# EAGLE design big7segment (EAGLE 6.5.0)
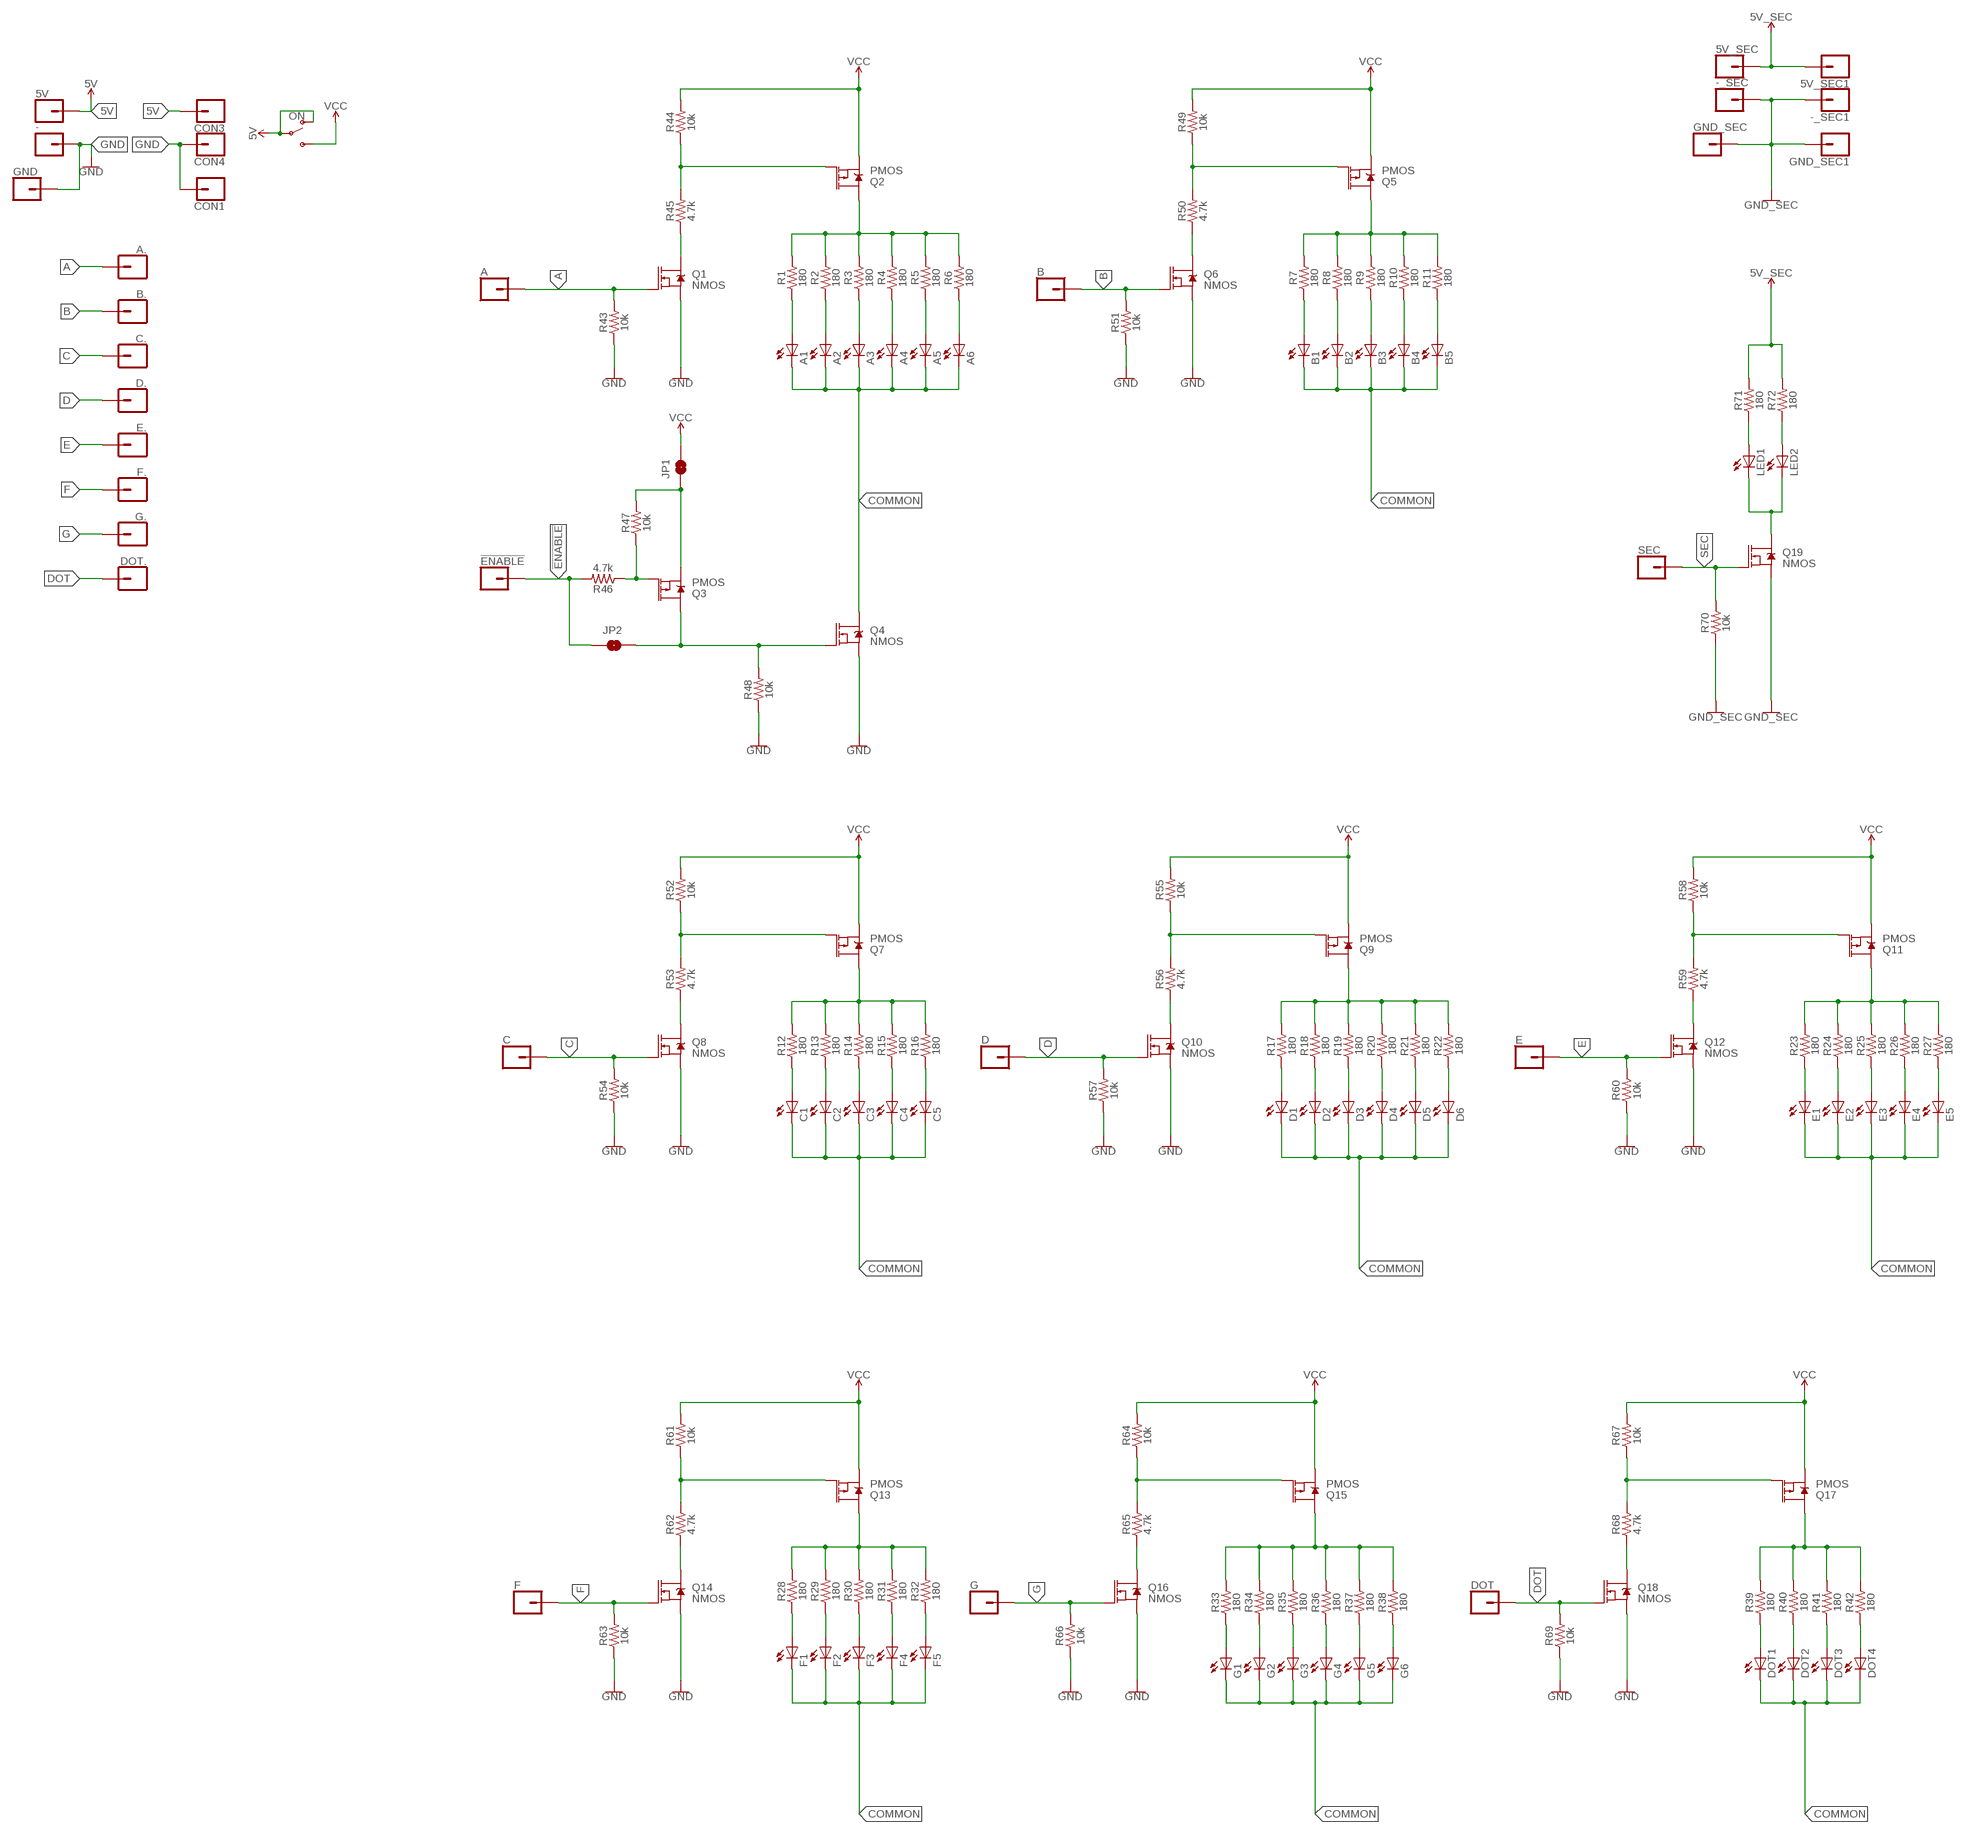
[diagram p0: schematic, sheet 1]

## Parts
5V  CONN_01OFFSET  [1X01_OFFSET]
5V_SEC  CONN_01OFFSET  [1X01_OFFSET]
5V_SEC1  CONN_01OFFSET  [1X01_OFFSET]
!ENABLE!  CONN_01OFFSET  [1X01_OFFSET]
-  CONN_01OFFSET  [1X01_OFFSET]
-_SEC  CONN_01OFFSET  [1X01_OFFSET]
-_SEC1  CONN_01OFFSET  [1X01_OFFSET]
A  CONN_01OFFSET  [1X01_OFFSET]
A1  LEDSML0805  [SML0805]
A2  LEDSML0805  [SML0805]
A3  LEDSML0805  [SML0805]
A4  LEDSML0805  [SML0805]
A5  LEDSML0805  [SML0805]
A6  LEDSML0805  [SML0805]
A.  CONN_01OFFSET  [1X01_OFFSET]
B  CONN_01OFFSET  [1X01_OFFSET]
B1  LEDSML0805  [SML0805]
B2  LEDSML0805  [SML0805]
B3  LEDSML0805  [SML0805]
B4  LEDSML0805  [SML0805]
B5  LEDSML0805  [SML0805]
B.  CONN_01OFFSET  [1X01_OFFSET]
C  CONN_01OFFSET  [1X01_OFFSET]
C1  LEDSML0805  [SML0805]
C2  LEDSML0805  [SML0805]
C3  LEDSML0805  [SML0805]
C4  LEDSML0805  [SML0805]
C5  LEDSML0805  [SML0805]
C.  CONN_01OFFSET  [1X01_OFFSET]
CON1  CONN_01OFFSET  [1X01_OFFSET]
CON3  CONN_01OFFSET  [1X01_OFFSET]
CON4  CONN_01OFFSET  [1X01_OFFSET]
D  CONN_01OFFSET  [1X01_OFFSET]
D1  LEDSML0805  [SML0805]
D2  LEDSML0805  [SML0805]
D3  LEDSML0805  [SML0805]
D4  LEDSML0805  [SML0805]
D5  LEDSML0805  [SML0805]
D6  LEDSML0805  [SML0805]
D.  CONN_01OFFSET  [1X01_OFFSET]
DOT  CONN_01OFFSET  [1X01_OFFSET]
DOT1  LEDSML0805  [SML0805]
DOT2  LEDSML0805  [SML0805]
DOT3  LEDSML0805  [SML0805]
DOT4  LEDSML0805  [SML0805]
DOT.  CONN_01OFFSET  [1X01_OFFSET]
E  CONN_01OFFSET  [1X01_OFFSET]
E1  LEDSML0805  [SML0805]
E2  LEDSML0805  [SML0805]
E3  LEDSML0805  [SML0805]
E4  LEDSML0805  [SML0805]
E5  LEDSML0805  [SML0805]
E.  CONN_01OFFSET  [1X01_OFFSET]
F  CONN_01OFFSET  [1X01_OFFSET]
F1  LEDSML0805  [SML0805]
F2  LEDSML0805  [SML0805]
F3  LEDSML0805  [SML0805]
F4  LEDSML0805  [SML0805]
F5  LEDSML0805  [SML0805]
F.  CONN_01OFFSET  [1X01_OFFSET]
G  CONN_01OFFSET  [1X01_OFFSET]
G1  LEDSML0805  [SML0805]
G2  LEDSML0805  [SML0805]
G3  LEDSML0805  [SML0805]
G4  LEDSML0805  [SML0805]
G5  LEDSML0805  [SML0805]
G6  LEDSML0805  [SML0805]
G.  CONN_01OFFSET  [1X01_OFFSET]
GND  CONN_01OFFSET  [1X01_OFFSET]
GND_SEC  CONN_01OFFSET  [1X01_OFFSET]
GND_SEC1  CONN_01OFFSET  [1X01_OFFSET]
JP1  JUMPER-SMT_2_NC_TRACE_NO-SILK  [SMT-JUMPER_2_NC_TRACE_NO-SILK]
JP2  JUMPER-SMT_2_NO_NO-SILK  [SMT-JUMPER_2_NO_NO-SILK]
LED1  LED5MM  [LED5MM]
LED2  LED5MM  [LED5MM]
ON  SWITCH-SPDT-PTH-11.6X4.0MM  [SWITCH_SPDT_PTH_11.6X4.0MM]
Q1  NMOS  MOSFET-NCH-AO3404A  [SOT23-3]
Q2  PMOS  MOSFET_PCH-DMG2307L  [SOT23-3]
Q3  PMOS  MOSFET_PCH-DMG2307L  [SOT23-3]
Q4  NMOS  MOSFET-NCH-AO3404A  [SOT23-3]
Q5  PMOS  MOSFET_PCH-DMG2307L  [SOT23-3]
Q6  NMOS  MOSFET-NCH-AO3404A  [SOT23-3]
Q7  PMOS  MOSFET_PCH-DMG2307L  [SOT23-3]
Q8  NMOS  MOSFET-NCH-AO3404A  [SOT23-3]
Q9  PMOS  MOSFET_PCH-DMG2307L  [SOT23-3]
Q10  NMOS  MOSFET-NCH-AO3404A  [SOT23-3]
Q11  PMOS  MOSFET_PCH-DMG2307L  [SOT23-3]
Q12  NMOS  MOSFET-NCH-AO3404A  [SOT23-3]
Q13  PMOS  MOSFET_PCH-DMG2307L  [SOT23-3]
Q14  NMOS  MOSFET-NCH-AO3404A  [SOT23-3]
Q15  PMOS  MOSFET_PCH-DMG2307L  [SOT23-3]
Q16  NMOS  MOSFET-NCH-AO3404A  [SOT23-3]
Q17  PMOS  MOSFET_PCH-DMG2307L  [SOT23-3]
Q18  NMOS  MOSFET-NCH-AO3404A  [SOT23-3]
Q19  NMOS  MOSFET-NCH-AO3404A  [SOT23-3]
R1  180  0.3OHM-0805-1/8W-1%  [0805]
R2  180  0.3OHM-0805-1/8W-1%  [0805]
R3  180  0.3OHM-0805-1/8W-1%  [0805]
R4  180  0.3OHM-0805-1/8W-1%  [0805]
R5  180  0.3OHM-0805-1/8W-1%  [0805]
R6  180  0.3OHM-0805-1/8W-1%  [0805]
R7  180  0.3OHM-0805-1/8W-1%  [0805]
R8  180  0.3OHM-0805-1/8W-1%  [0805]
R9  180  0.3OHM-0805-1/8W-1%  [0805]
R10  180  0.3OHM-0805-1/8W-1%  [0805]
R11  180  0.3OHM-0805-1/8W-1%  [0805]
R12  180  0.3OHM-0805-1/8W-1%  [0805]
R13  180  0.3OHM-0805-1/8W-1%  [0805]
R14  180  0.3OHM-0805-1/8W-1%  [0805]
R15  180  0.3OHM-0805-1/8W-1%  [0805]
R16  180  0.3OHM-0805-1/8W-1%  [0805]
R17  180  0.3OHM-0805-1/8W-1%  [0805]
R18  180  0.3OHM-0805-1/8W-1%  [0805]
R19  180  0.3OHM-0805-1/8W-1%  [0805]
R20  180  0.3OHM-0805-1/8W-1%  [0805]
R21  180  0.3OHM-0805-1/8W-1%  [0805]
R22  180  0.3OHM-0805-1/8W-1%  [0805]
R23  180  0.3OHM-0805-1/8W-1%  [0805]
R24  180  0.3OHM-0805-1/8W-1%  [0805]
R25  180  0.3OHM-0805-1/8W-1%  [0805]
R26  180  0.3OHM-0805-1/8W-1%  [0805]
R27  180  0.3OHM-0805-1/8W-1%  [0805]
R28  180  0.3OHM-0805-1/8W-1%  [0805]
R29  180  0.3OHM-0805-1/8W-1%  [0805]
R30  180  0.3OHM-0805-1/8W-1%  [0805]
R31  180  0.3OHM-0805-1/8W-1%  [0805]
R32  180  0.3OHM-0805-1/8W-1%  [0805]
R33  180  0.3OHM-0805-1/8W-1%  [0805]
R34  180  0.3OHM-0805-1/8W-1%  [0805]
R35  180  0.3OHM-0805-1/8W-1%  [0805]
R36  180  0.3OHM-0805-1/8W-1%  [0805]
R37  180  0.3OHM-0805-1/8W-1%  [0805]
R38  180  0.3OHM-0805-1/8W-1%  [0805]
R39  180  0.3OHM-0805-1/8W-1%  [0805]
R40  180  0.3OHM-0805-1/8W-1%  [0805]
R41  180  0.3OHM-0805-1/8W-1%  [0805]
R42  180  0.3OHM-0805-1/8W-1%  [0805]
R43  10k  0.3OHM-0805-1/8W-1%  [0805]
R44  10k  0.3OHM-0805-1/8W-1%  [0805]
R45  4.7k  0.3OHM-0805-1/8W-1%  [0805]
R46  4.7k  0.3OHM-0805-1/8W-1%  [0805]
R47  10k  0.3OHM-0805-1/8W-1%  [0805]
R48  10k  0.3OHM-0805-1/8W-1%  [0805]
R49  10k  0.3OHM-0805-1/8W-1%  [0805]
R50  4.7k  0.3OHM-0805-1/8W-1%  [0805]
R51  10k  0.3OHM-0805-1/8W-1%  [0805]
R52  10k  0.3OHM-0805-1/8W-1%  [0805]
R53  4.7k  0.3OHM-0805-1/8W-1%  [0805]
R54  10k  0.3OHM-0805-1/8W-1%  [0805]
R55  10k  0.3OHM-0805-1/8W-1%  [0805]
R56  4.7k  0.3OHM-0805-1/8W-1%  [0805]
R57  10k  0.3OHM-0805-1/8W-1%  [0805]
R58  10k  0.3OHM-0805-1/8W-1%  [0805]
R59  4.7k  0.3OHM-0805-1/8W-1%  [0805]
R60  10k  0.3OHM-0805-1/8W-1%  [0805]
R61  10k  0.3OHM-0805-1/8W-1%  [0805]
R62  4.7k  0.3OHM-0805-1/8W-1%  [0805]
R63  10k  0.3OHM-0805-1/8W-1%  [0805]
R64  10k  0.3OHM-0805-1/8W-1%  [0805]
R65  4.7k  0.3OHM-0805-1/8W-1%  [0805]
R66  10k  0.3OHM-0805-1/8W-1%  [0805]
R67  10k  0.3OHM-0805-1/8W-1%  [0805]
R68  4.7k  0.3OHM-0805-1/8W-1%  [0805]
R69  10k  0.3OHM-0805-1/8W-1%  [0805]
R70  10k  0.3OHM-0805-1/8W-1%  [0805]
R71  180  0.3OHM-0805-1/8W-1%  [0805]
R72  180  0.3OHM-0805-1/8W-1%  [0805]
SEC  CONN_01OFFSET  [1X01_OFFSET]

## Nets
5V: 5V.1 CON3.1 ON.1(O) ON.2(P)
!ENABLE!: !ENABLE!.1 JP2.1 R46.2
A: A.1 A..1 Q1.1(G) R43.2
B: B.1 B..1 Q6.1(G) R51.2
C: C.1 C..1 Q8.1(G) R54.2
COMMON: A1.C A2.C A3.C A4.C A5.C A6.C B1.C B2.C B3.C B4.C B5.C C1.C C2.C C3.C C4.C C5.C D1.C D2.C D3.C D4.C D5.C D6.C DOT1.C DOT2.C DOT3.C DOT4.C E1.C E2.C E3.C E4.C E5.C F1.C F2.C F3.C F4.C F5.C G1.C G2.C G3.C G4.C G5.C G6.C Q4.3(D)
D: D.1 D..1 Q10.1(G) R57.2
DOT: DOT.1 DOT..1 Q18.1(G) R69.2
E: E.1 E..1 Q12.1(G) R60.2
F: F.1 F..1 Q14.1(G) R63.2
G: G.1 G..1 Q16.1(G) R66.2
GND: -.1 CON1.1 CON4.1 GND.1 Q1.2(S) Q4.2(S) Q6.2(S) Q8.2(S) Q10.2(S) Q12.2(S) Q14.2(S) Q16.2(S) Q18.2(S) R43.1 R48.1 R51.1 R54.1 R57.1 R60.1 R63.1 R66.1 R69.1
GND_SEC: -_SEC1.1 -_SEC.1 GND_SEC1.1 GND_SEC.1 Q19.2(S) R70.1
N$1: A1.A R1.1
N$2: A3.A R3.1
N$3: A4.A R4.1
N$4: A5.A R5.1
N$5: A6.A R6.1
N$6: A2.A R2.1
N$7: B1.A R7.1
N$8: B2.A R8.1
N$9: B3.A R9.1
N$10: B4.A R10.1
N$11: B5.A R11.1
N$12: C1.A R12.1
N$13: C2.A R13.1
N$14: C3.A R14.1
N$15: C4.A R15.1
N$16: C5.A R16.1
N$17: D1.A R17.1
N$18: D2.A R18.1
N$19: D3.A R19.1
N$20: D4.A R20.1
N$21: D5.A R21.1
N$22: D6.A R22.1
N$23: E1.A R23.1
N$24: E2.A R24.1
N$25: E3.A R25.1
N$26: E4.A R26.1
N$27: E5.A R27.1
N$28: F1.A R28.1
N$29: F2.A R29.1
N$30: F3.A R30.1
N$31: F4.A R31.1
N$32: F5.A R32.1
N$33: G1.A R33.1
N$34: G2.A R34.1
N$35: G3.A R35.1
N$36: G4.A R36.1
N$37: G5.A R37.1
N$38: G6.A R38.1
N$39: DOT1.A R39.1
N$40: DOT2.A R40.1
N$41: DOT3.A R41.1
N$42: DOT4.A R42.1
N$43: Q2.1(G) R44.1 R45.2
N$44: Q1.3(D) R45.1
N$45: Q5.1(G) R49.1 R50.2
N$46: Q2.3(D) R1.2 R2.2 R3.2 R4.2 R5.2 R6.2
N$47: Q3.1(G) R46.1 R47.1
N$48: JP2.2 Q3.3(D) Q4.1(G) R48.2
N$49: Q5.3(D) R7.2 R8.2 R9.2 R10.2 R11.2
N$50: Q11.1(G) R58.1 R59.2
N$51: Q12.3(D) R59.1
N$52: Q6.3(D) R50.1
N$53: Q7.1(G) R52.1 R53.2
N$54: Q8.3(D) R53.1
N$55: Q7.3(D) R12.2 R13.2 R14.2 R15.2 R16.2
N$56: Q9.1(G) R55.1 R56.2
N$57: Q10.3(D) R56.1
N$58: Q9.3(D) R17.2 R18.2 R19.2 R20.2 R21.2 R22.2
N$59: Q13.3(D) R28.2 R29.2 R30.2 R31.2 R32.2
N$60: Q13.1(G) R61.1 R62.2
N$61: Q14.3(D) R62.1
N$62: Q15.3(D) R33.2 R34.2 R35.2 R36.2 R37.2 R38.2
N$63: Q15.1(G) R64.1 R65.2
N$64: Q16.3(D) R65.1
N$65: Q17.3(D) R39.2 R40.2 R41.2 R42.2
N$66: Q17.1(G) R67.1 R68.2
N$67: Q18.3(D) R68.1
N$68: JP1.1 Q3.2(S) R47.2
N$69: Q11.3(D) R23.2 R24.2 R25.2 R26.2 R27.2
N$70: LED2.A R72.1
N$71: LED1.A R71.1
N$75: LED1.K(C) LED2.K(C) Q19.3(D)
SEC: Q19.1(G) R70.2 SEC.1
VCC: JP1.2 ON.3(S) Q2.2(S) Q5.2(S) Q7.2(S) Q9.2(S) Q11.2(S) Q13.2(S) Q15.2(S) Q17.2(S) R44.2 R49.2 R52.2 R55.2 R58.2 R61.2 R64.2 R67.2
VCC_1: 5V_SEC1.1 5V_SEC.1 R71.2 R72.2 ; supply symbol labelled 5V_SEC

## Library data of the parts
5V 5V_SEC 5V_SEC1 !ENABLE! - -_SEC -_SEC1 A A. B B. C C. CON1 CON3 CON4 D D. DOT DOT. E E. F F. G G. GND GND_SEC GND_SEC1 SEC = SparkFun-Connectors:CONN_01: Single connection point. Often used as Generic Header-pin footprint for 0.1 inch spaced/style header connections On any of the 0.1 inch spaced packages, you can populate with these: Break Away Headers - Straight <https://www.sparkfun.com/products/116> (PRT-00116) Break Away Male Headers - Right Angle <https://www.sparkfun.com/products/553> (PRT-00553) Female Headers <https://www.sparkfun.com/products/115> (PRT-00115) Break Away Headers - Machine Pin <https://www.sparkfun.com/products/117> (PRT-00117) Break Away Female Headers - Swiss Machine Pin <https://www.sparkfun.com/products/743> (PRT-00743) This device is also useful as a general connection point to wire up your design to another part of your project. Our various solder wires solder well into these plated through hole pads. Hook-Up Wire - Assortment (Stranded, 22 AWG) <https://www.sparkfun.com/products/11375> (PRT-11375) Hook-Up Wire - Assortment (Solid Core, 22 AWG) <https://www.sparkfun.com/products/11367> (PRT-11367) View the entire wire category on our website here <https://www.sparkfun.com/categories/141> Special notes: SMTSO-256-ET is a "flush mount" nut for a 4-40 screw. We mostly use this on specialty testbeds; it is a nice way to connect hardware to your PCB at an adjustable hieght. Also note, the SNAP packages are for using a snappable style connector. We sell a baggie of snaps and they are also used on two LilyPad designs: Snap Assortment - 30 pack (male and female) <https://www.sparkfun.com/products/11347> (DEV-11347) LilyPad Arduino SimpleSnap <https://www.sparkfun.com/products/10941> (DEV-10941) LilyPad SimpleSnap Protoboard <https://www.sparkfun.com/products/10940> (DEV-10940)
A1-A6 B1-B5 C1-C5 D1-D6 DOT1-DOT4 E1-E5 F1-F5 G1-G6 LED1 LED2 = led:LED: LED OSRAM: - CHIPLED LG R971, LG N971, LY N971, LG Q971, LY Q971, LO R971, LY R971 LH N974, LH R974 LS Q976, LO Q976, LY Q976 LO Q996 - Hyper CHIPLED LW Q18S LB Q993, LB Q99A, LB R99A - SideLED LS A670, LO A670, LY A670, LG A670, LP A670 LB A673, LV A673, LT A673, LW A673 LH A674 LY A675 LS A676, LA A676, LO A676, LY A676, LW A676 LS A679, LY A679, LG A679 - Hyper Micro SIDELED® LS Y876, LA Y876, LO Y876, LY Y876 LT Y87S - SmartLED LW L88C, LW L88S LB L89C, LB L89S, LG L890 LS L89K, LO L89K, LY L89K LS L896, LA L896, LO L896, LY L896 - TOPLED LS T670, LO T670, LY T670, LG T670, LP T670 LSG T670, LSP T670, LSY T670, LOP T670, LYG T670 LG T671, LOG T671, LSG T671 LB T673, LV T673, LT T673, LW T673 LH T674 LS T676, LA T676, LO T676, LY T676, LB T676, LH T676, LSB T676, LW T676 LB T67C, LV T67C, LT T67C, LS T67K, LO T67K, LY T67K, LW E67C LS E67B, LA E67B, LO E67B, LY E67B, LB E67C, LV E67C, LT E67C LW T67C LS T679, LY T679, LG T679 LS T770, LO T770, LY T770, LG T770, LP T770 LB T773, LV T773, LT T773, LW T773 LH T774 LS E675, LA E675, LY E675, LS T675 LS T776, LA T776, LO T776, LY T776, LB T776 LHGB T686 LT T68C, LB T68C - Hyper Mini TOPLED® LB M676 - Mini TOPLED Santana® LG M470 LS M47K, LO M47K, LY M47K Source: http://www.osram.convergy.de LUXEON: - LUMILED® LXK2-PW12-R00, LXK2-PW12-S00, LXK2-PW14-U00, LXK2-PW14-V00 LXK2-PM12-R00, LXK2-PM12-S00, LXK2-PM14-U00 LXK2-PE12-Q00, LXK2-PE12-R00, LXK2-PE12-S00, LXK2-PE14-T00, LXK2-PE14-U00 LXK2-PB12-K00, LXK2-PB12-L00, LXK2-PB12-M00, LXK2-PB14-N00, LXK2-PB14-P00, LXK2-PB14-Q00 LXK2-PR12-L00, LXK2-PR12-M00, LXK2-PR14-Q00, LXK2-PR14-R00 LXK2-PD12-Q00, LXK2-PD12-R00, LXK2-PD12-S00 LXK2-PH12-R00, LXK2-PH12-S00 LXK2-PL12-P00, LXK2-PL12-Q00, LXK2-PL12-R00 Source: www.luxeon.com KINGBRIGHT: KA-3528ASYC Source: www.kingbright.com
JP1 = SparkFun-Jumpers:JUMPER-SMT_2_NC_TRACE: Normally closed trace jumper This jumper has a trace between two pads so it's normally closed (NC). Use a razor knife to open the connection. For best results follow the IPC guidelines for cutting traces: Cutout at least 0.063 mm (0.005 in). Remove all loose material to clean up the cut area. Seal the cut with an approved epoxy. Reapply solder to reclose the connection.
JP2 = SparkFun-Jumpers:JUMPER-SMT_2_NO: Normally open jumper This jumper has two pads in close proximity to each other. Apply solder to close the connection. Round pads are easier to solder for beginners, but are a lot larger. SparkFun Product that uses the round pads: SparkFun EL Sequencer <https://www.sparkfun.com/products/12781>
ON = SparkFun-Switches:SWITCH-SPDT: Single Pole, Double Throw (SPDT) Switch Single-pole, double-throw (SPDT) switch. Variant Overview SMD-AYZ0202 Surface Mount DPDT Switch <https://www.sparkfun.com/products/597> (COM-00597) Used on e.g. LilyPad Arduino USB - ATmega32U4 Board <https://www.sparkfun.com/products/12049> PTH-11.6X4.0MM SPDT Mini Power Switch <https://www.sparkfun.com/products/102> (COM-00102) Used on e.g. SparkFun Simon Says - Through-Hole Soldering Kit <https://www.sparkfun.com/products/10547> (KIT-10547) PTH-11.6X4.0MM-KIT KIT version of SPDT Mini Power Switch - Simplifies soldering by removing tStop of switch pins - only one side can be soldered. PTH-11.6X4.0MM-LOCK LOCK version of SPDT Mini Power Switch - Offset pins hold switch in place for easier soldering. SMD-RIGHT-ANGLE Surface Mount Right Angle Switch <https://www.sparkfun.com/products/10860> (COM-10860) Used on e.g. SparkFun ESP8266 Thing <https://www.sparkfun.com/products/13231>; PROD_ID: SWCH-08261; SF_SKU: COM-00102
Q1 Q4 Q6 Q8 Q10 Q12 Q14 Q16 Q18 Q19 = SparkFun-DiscreteSemi:MOSFET-NCH: N-channel MOSFETs Voltage controlled devices that allow control of high current outputs. SparkFun Products: SparkFun OpenScale <https://www.sparkfun.com/products/13261> SparkFun Digital Sandbox <https://www.sparkfun.com/products/12651> SparkFun Monster Moto Shield <https://www.sparkfun.com/products/10182> SparkFun MOSFET Power Controller <https://www.sparkfun.com/products/11214>; PROD_ID: TRANS-12988; VALUE: 5.8A/30V/35mΩ
Q2 Q3 Q5 Q7 Q9 Q11 Q13 Q15 Q17 = SparkFun-DiscreteSemi:MOSFET_PCH: P-channel MOSFETs Voltage controlled devices that allow control of high current outputs. SparkFun Products: SparkFun ESP32 Thing <https://www.sparkfun.com/products/13907> SparkFun ESP8266 Thing <https://www.sparkfun.com/products/13231>; PROD_ID: TRANS-11308; VALUE: 2.5A/30V/105mΩ
R1-R72 = SparkFun-Resistors:0.3OHM: 0.3Ω resistor A resistor is a passive two-terminal electrical component that implements electrical resistance as a circuit element. Resistors act to reduce current flow, and, at the same time, act to lower voltage levels within circuits. - Wikipedia; PROD_ID: RES-11622; VALUE: 0.3

## Board
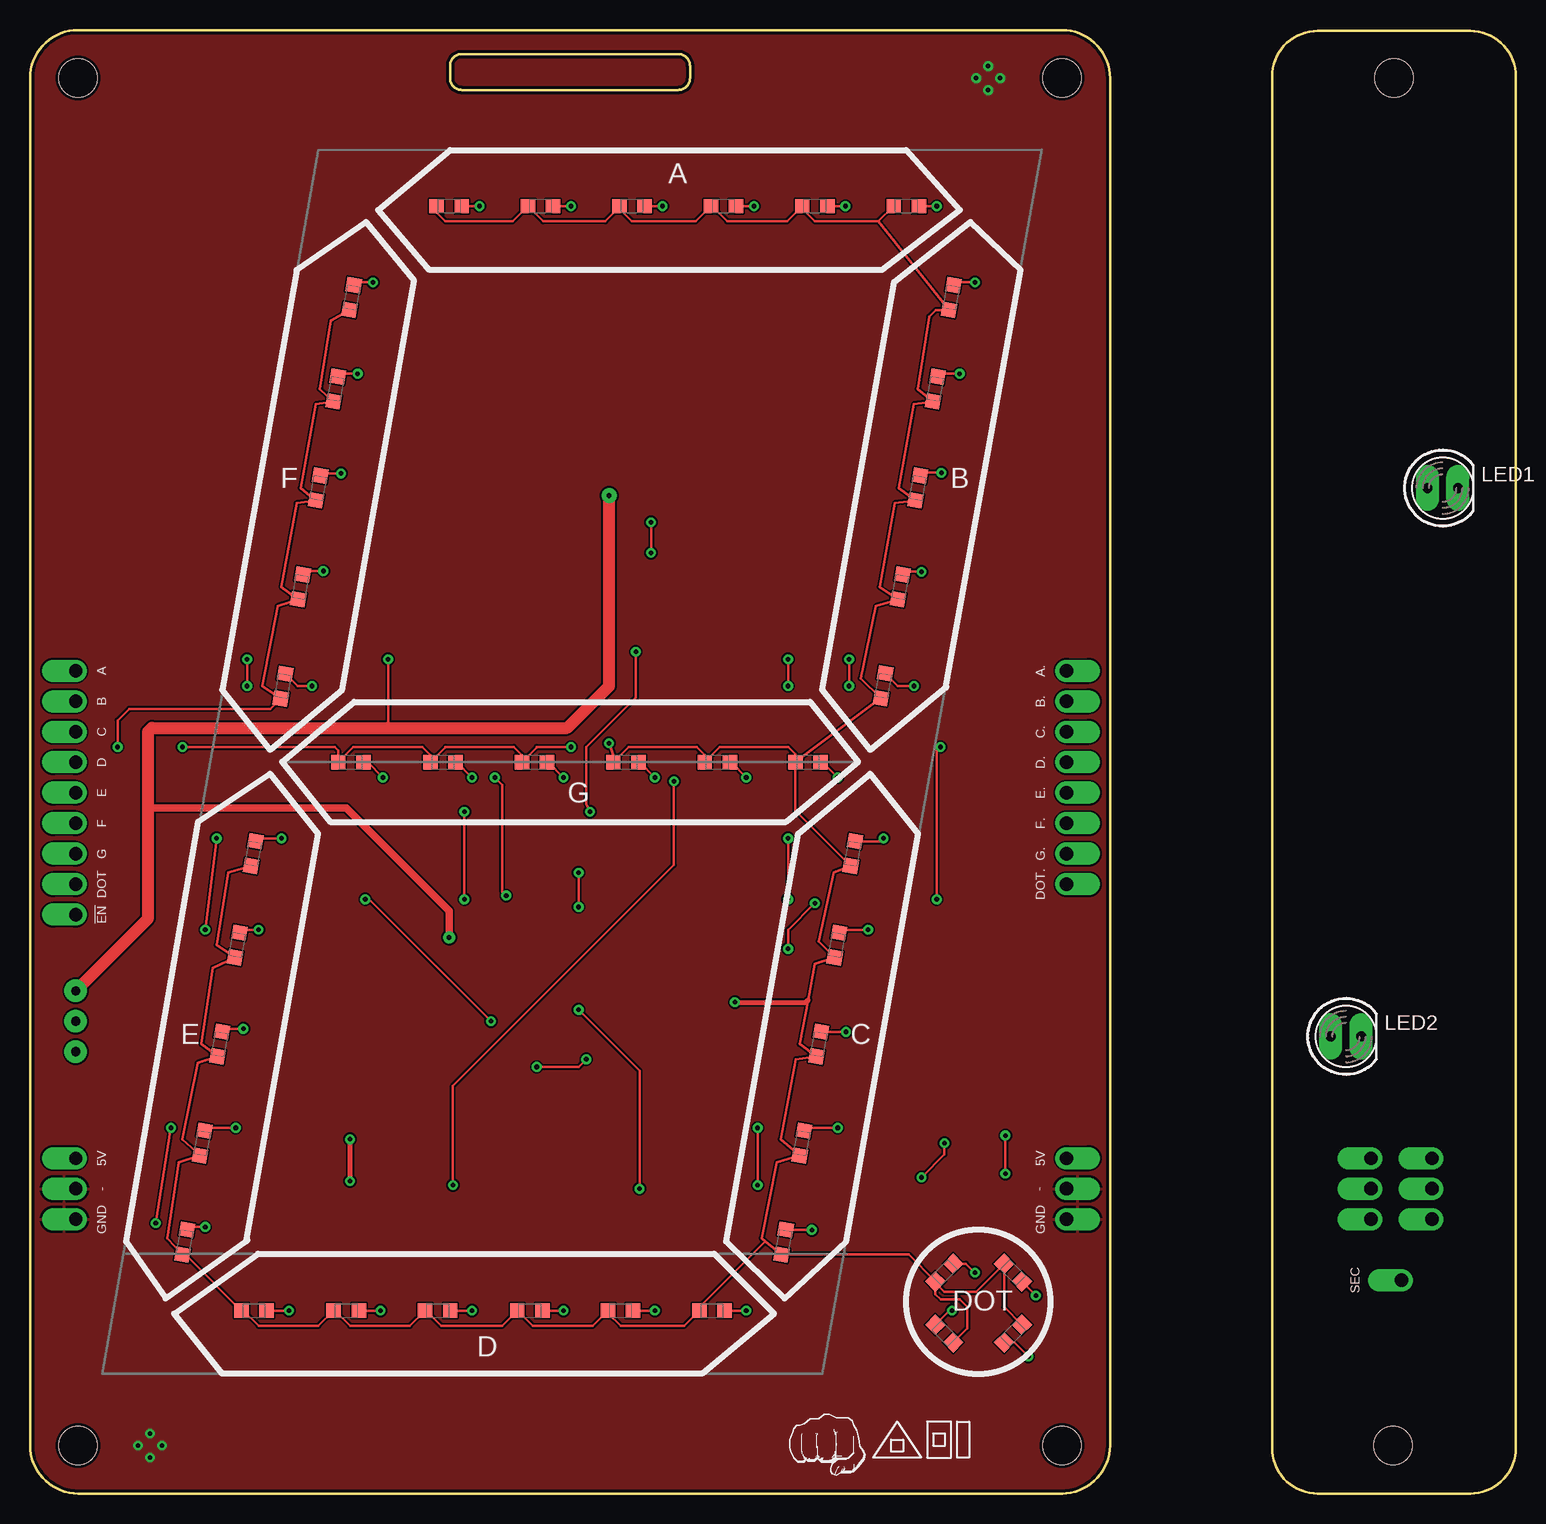
[diagram p1: board, top side]
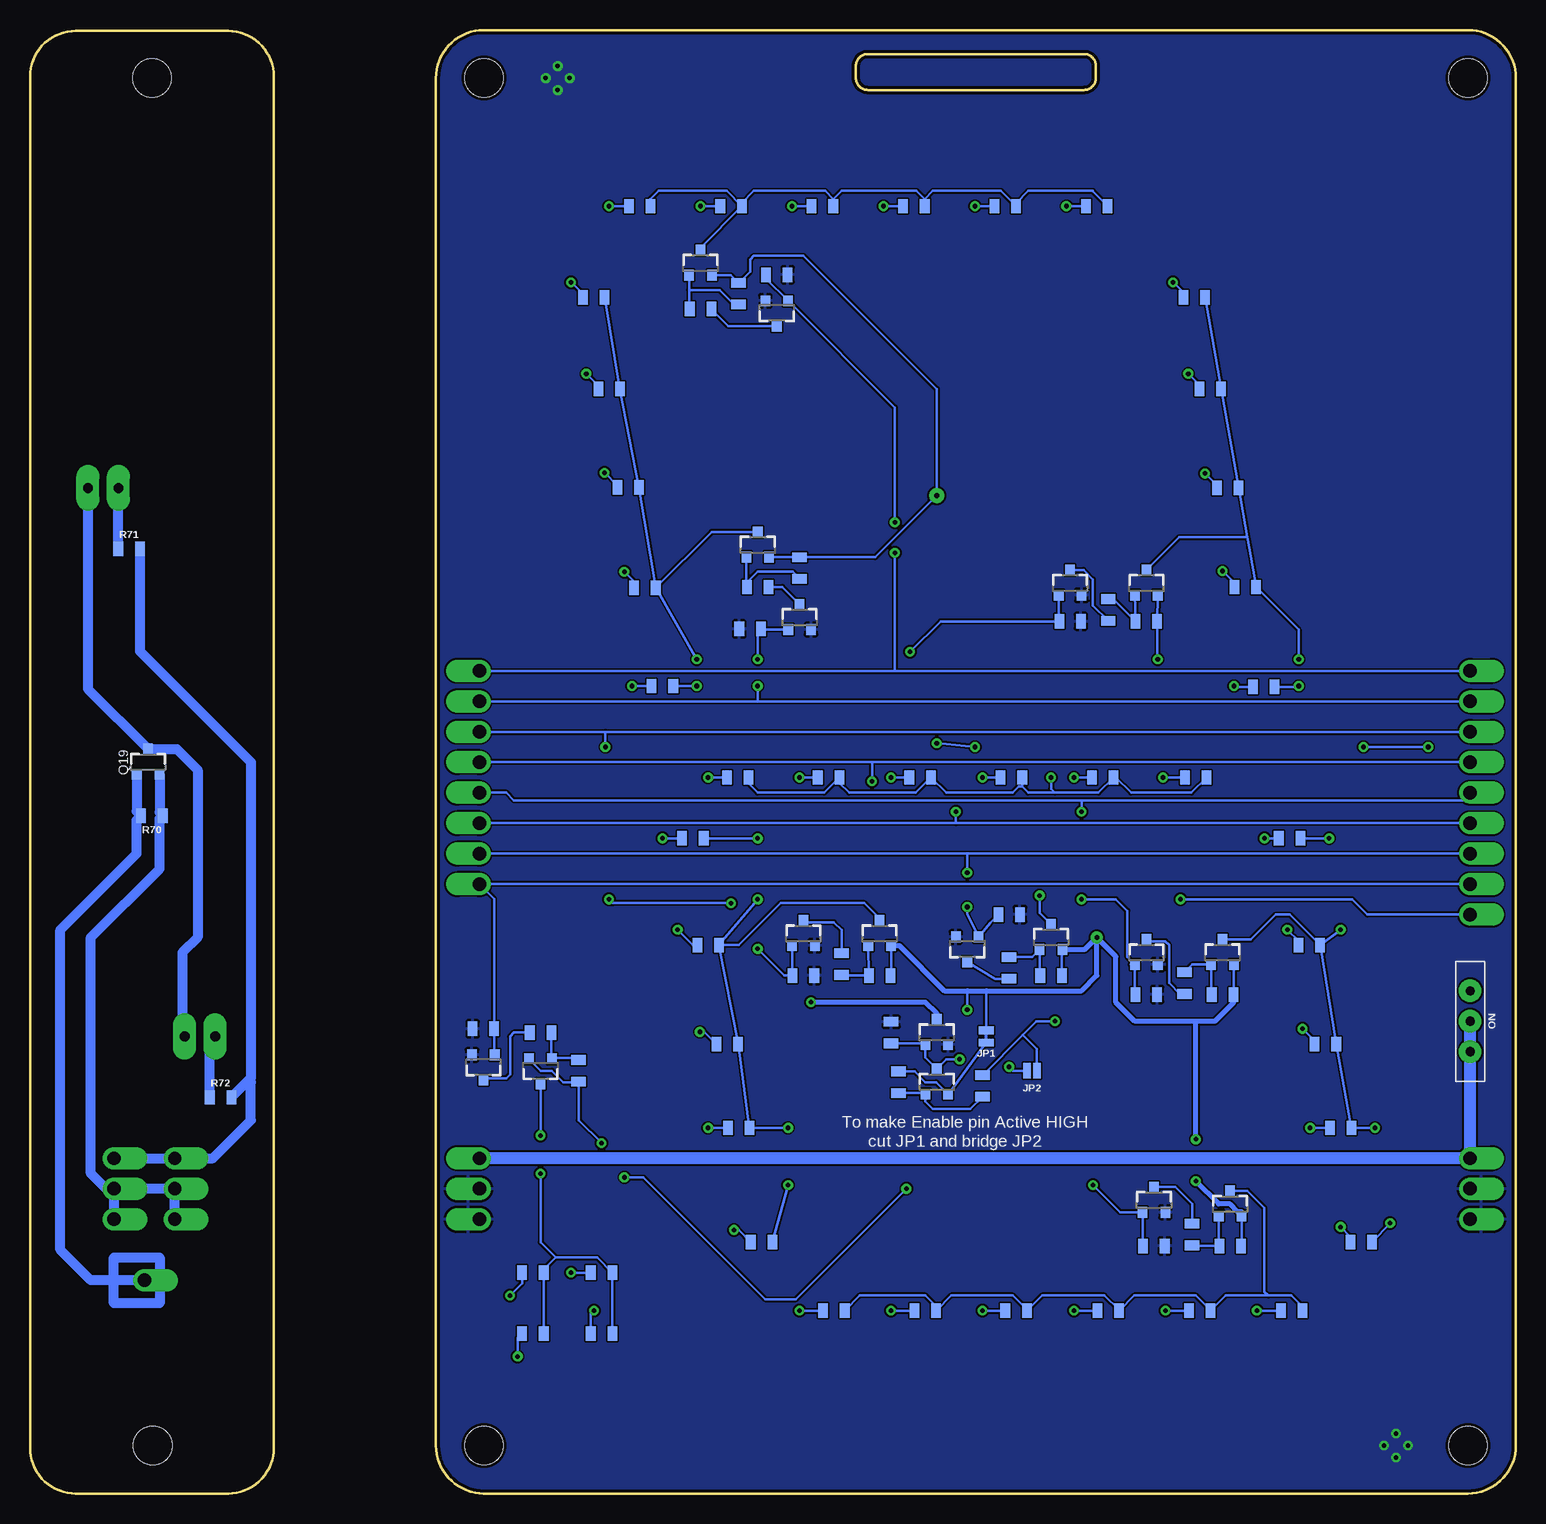
[diagram p2: board, bottom side, seen from below]

Size 123.83 x 122 mm. Coordinates in mm from the lower left corner, seen from the top.
Outline: 4,122 86,122 arc-90 90,118 90,4 arc-90 86,0 4,0 arc-90 0,4 0,118 arc-90 4,122
Outline: 36,120 54,120 arc-90 55,119 55,118 arc-90 54,117 36,117 arc-90 35,118 35,119 arc-90 36,120
Outline: 120.02,121.92 107.31,121.92 arc90 103.5,118.11 103.5,3.81 arc90 107.31,0 120.02,0 arc90 123.83,3.81 123.83,118.11 arc90 120.02,121.92
Copper layers (1*16): Top 0.035mm / dielectric 1.5mm / Bottom 0.035mm
Design rules "SeeedStudio_2layer_DRU_no_angle_20140221 *": minimum track width 6mil, minimum drill 12mil, track to track 6mil, track to pad 6mil, pad to pad 6mil, via to via 6mil, smd to smd 0mil, copper to edge 10mil, drill to drill 10mil, minimum pad ring 10mil, minimum via ring 6mil, stop-mask expansion 2mil, vias tented up to drill 20mil, thermal gap 8mil
Holes 3.2 mm at 4,118 86,118 86,4 4,4 113.66,118 113.6,4

### Footprints (pad centres in the part's own frame; a part is rotated, then mirrored left to right if it is on the bottom)
1X01_OFFSET = drill 1.118 pad 1.88 offset: 1 0,0
SML0805 = smd 1.2 x 1.2: A 1.05,0; C -1.05,0
SMT-JUMPER_2_NC_TRACE_NO-SILK = smd 0.635 x 1.27: 1 -0.508,0; 2 0.508,0
SMT-JUMPER_2_NO_NO-SILK = smd 0.635 x 1.27: 1 -0.406,0; 2 0.406,0
LED5MM = drill 0.813 pad 1.93 long: A -1.27,0; K 1.27,0
SWITCH_SPDT_PTH_11.6X4.0MM = drill 0.762 pad 1.88: 1 0,2.54; 2 0,0; 3 0,-2.54
SOT23-3 = smd 0.8 x 0.9: 1 -0.95,-1; 2 0.95,-1; 3 0,1.1
0805 = smd 0.8 x 1.2: 1 -0.9,0; 2 0.9,0

### Placement (x,y rotation side)
5V  3.81,27.94 90 top
5V_SEC  116.84,27.94 90 top
5V_SEC1  111.76,27.94 90 top
!ENABLE!  3.81,48.26 90 top
-  3.81,25.4 90 top
-_SEC  116.84,25.4 90 top
-_SEC1  111.76,25.4 90 top
A  3.81,68.58 90 top
A1  34.92,107.31 0 top
A2  42.55,107.31 0 top
A3  50.16,107.31 0 top
A4  57.78,107.31 0 top
A5  65.41,107.31 0 top
A6  73.03,107.31 0 top
A.  86.36,68.58 270 top
B  3.81,66.04 90 top
B1  76.77,99.7 80 top
B2  75.44,92.08 80 top
B3  73.98,83.82 80 top
B4  72.52,75.56 80 top
B5  71.09,67.33 80 top
B.  86.36,66.04 270 top
C  3.81,63.5 90 top
C1  68.58,53.34 80 top
C2  67.25,45.72 80 top
C3  65.72,37.47 80 top
C4  64.33,29.21 80 top
C5  62.8,20.95 80 top
C.  86.36,63.5 270 top
CON1  86.36,22.86 270 top
CON3  86.36,27.94 270 top
CON4  86.36,25.4 270 top
D  3.81,60.96 90 top
D1  18.67,15.24 0 top
D2  26.35,15.24 0 top
D3  33.97,15.24 0 top
D4  41.66,15.24 0 top
D5  49.21,15.24 0 top
D6  56.83,15.24 0 top
D.  86.36,60.96 270 top
DOT  3.81,50.8 90 top
DOT1  76.2,18.41 45 top
DOT2  81.92,18.41 315 top
DOT3  81.92,13.34 225 top
DOT4  76.2,13.34 135 top
DOT.  86.36,50.8 270 top
E  3.81,58.42 90 top
E1  18.61,53.34 80 top
E2  17.27,45.72 80 top
E3  15.81,37.47 80 top
E4  14.35,29.21 80 top
E5  12.89,20.95 80 top
E.  86.36,58.42 270 top
F  3.81,55.88 90 top
F1  26.8,99.69 80 top
F2  25.46,92.08 80 top
F3  24,83.82 80 top
F4  22.54,75.56 80 top
F5  21.08,67.31 80 top
F.  86.36,55.88 270 top
G  3.81,53.34 90 top
G1  26.73,60.96 0 top
G2  34.42,60.96 0 top
G3  42.04,60.96 0 top
G4  49.66,60.96 0 top
G5  57.28,60.96 0 top
G6  64.83,60.96 0 top
G.  86.36,53.34 270 top
GND  3.81,22.86 90 top
GND_SEC  116.84,22.86 90 top
GND_SEC1  111.76,22.86 90 top
JP1  44.13,38.1 90 bottom
JP2  40.32,35.24 180 bottom
LED1  117.73,83.82 0 top
LED2  109.66,38.1 0 top
ON  3.81,39.37 180 bottom
Q1  61.59,98.42 180 bottom
Q2  67.94,102.55 0 bottom
Q3  48.26,34.29 0 bottom
Q4  48.26,38.42 0 bottom
Q5  63.18,79.06 0 bottom
Q6  59.69,73.03 0 bottom
Q7  53.02,46.67 0 bottom
Q8  59.37,46.67 0 bottom
Q9  23.81,24.13 0 bottom
Q10  30.16,24.45 0 bottom
Q11  24.45,45.09 0 bottom
Q12  30.8,45.09 0 bottom
Q13  30.8,75.88 0 bottom
Q14  37.15,75.88 0 bottom
Q15  38.73,46.35 0 bottom
Q16  45.72,45.4 180 bottom
Q17  81.28,35.24 180 bottom
Q18  86.04,35.56 180 bottom
Q19  113.98,60.96 0 bottom
R1  34.92,107.31 0 bottom
R2  42.55,107.31 0 bottom
R3  50.16,107.31 0 bottom
R4  57.78,107.31 0 bottom
R5  65.41,107.31 0 bottom
R6  73.03,107.31 0 bottom
R7  76.83,99.69 0 bottom
R8  75.56,92.08 0 bottom
R9  73.98,83.88 0 bottom
R10  72.58,75.5 0 bottom
R11  71.12,67.31 0 bottom
R12  68.58,54.61 0 bottom
R13  67.31,45.72 0 bottom
R14  65.72,37.47 0 bottom
R15  64.77,30.48 0 bottom
R16  62.87,20.95 0 bottom
R17  18.67,15.24 0 bottom
R18  26.35,15.24 0 bottom
R19  33.97,15.24 0 bottom
R20  41.66,15.24 0 bottom
R21  49.21,15.24 0 bottom
R22  56.83,15.24 0 bottom
R23  18.86,54.61 0 bottom
R24  17.21,45.72 0 bottom
R25  15.88,37.47 0 bottom
R26  14.61,30.48 0 bottom
R27  12.89,20.95 0 bottom
R28  26.8,99.69 0 bottom
R29  25.46,92.08 0 bottom
R30  24,83.82 0 bottom
R31  22.54,75.56 0 bottom
R32  21.02,67.25 0 bottom
R33  26.67,59.69 0 bottom
R34  34.42,59.69 0 bottom
R35  42.04,59.69 0 bottom
R36  49.66,59.69 0 bottom
R37  57.28,59.69 0 bottom
R38  64.83,59.69 0 bottom
R39  76.2,18.41 0 bottom
R40  81.92,18.41 0 bottom
R41  81.92,13.34 0 bottom
R42  76.2,13.34 0 bottom
R43  61.59,101.6 180 bottom
R44  64.77,100.01 90 bottom
R45  67.94,98.74 180 bottom
R46  44.45,33.97 90 bottom
R47  51.44,34.29 90 bottom
R48  52.07,38.42 270 bottom
R49  59.69,77.15 90 bottom
R50  63.18,75.56 180 bottom
R51  63.82,72.07 0 bottom
R52  53.02,43.18 0 bottom
R53  56.2,44.13 270 bottom
R54  59.37,43.18 180 bottom
R55  23.81,20.64 0 bottom
R56  26.99,21.59 270 bottom
R57  30.16,20.64 180 bottom
R58  24.45,41.59 0 bottom
R59  27.62,42.55 90 bottom
R60  30.8,41.59 180 bottom
R61  30.8,72.71 0 bottom
R62  33.97,73.66 90 bottom
R63  37.15,72.71 180 bottom
R64  38.73,43.18 0 bottom
R65  42.23,43.81 90 bottom
R66  42.23,48.26 180 bottom
R67  78.11,35.24 270 bottom
R68  81.28,38.42 0 bottom
R69  86.04,38.73 0 bottom
R70  113.67,56.52 180 bottom
R71  115.57,78.74 0 bottom
R72  107.95,33.02 0 bottom
SEC  114.3,17.78 90 top
U$1  [ADILOGO]  71,3 0 top

### Tracks (layer width: path | path; a pad name or v marks a point on that pad's centre or on a via)
5V
  Bottom 0.203: 5V.1 5.06,27.94
  Bottom 1.016: CON3.1 5V.1 ON.1 ON.2
!ENABLE!  (via drill 0.38 pad 0.81)
  Top 0.203: v27.94,49.53 28.26,49.53 v38.42,39.37
  Bottom 0.203: !ENABLE!.1 12.38,48.26 13.65,49.53 v27.94,49.53 | v38.42,39.37 39.95,39.37 41.09,38.23 | 41.09,38.23 R46.2 | JP2.1 39.92,37.06 41.09,38.23
A  (via drill 0.38 pad 0.81)
  Top 0.203: v51.75,80.96 v51.75,78.42
  Bottom 0.203: A..1 51.75,68.58 | 51.75,68.58 A.1 | R43.2 62.49,101.28 Q1.1 51.75,90.53 v51.75,80.96 | v51.75,78.42 51.75,68.58
B  (via drill 0.38 pad 0.81)
  Top 0.203: v63.18,69.53 v63.18,67.31
  Bottom 0.203: B.1 63.18,66.04 | 63.18,66.04 B..1 | Q6.1 62.87,72.03 R51.2 63.18,71.81 v63.18,69.53 | v63.18,67.31 63.18,66.04
C  (via drill 0.38 pad 0.81)
  Top 0.203: v63.18,45.4 63.18,46.99 v65.41,49.21 | v75.56,49.53 75.56,61.91 v75.88,62.23
  Bottom 0.203: C..1 75.88,63.5 | 75.88,63.5 C.1 | Q8.1 60.32,43.23 R54.2 60.96,43.18 v63.18,45.4 | v65.41,49.21 75.25,49.21 v75.56,49.53 | v75.88,62.23 75.88,63.5
COMMON  (via drill 0.38 pad 0.81)
  Top 0.203: A1.C 33.88,106.78 34.61,106.05 40.23,106.05 A2.C 42.77,106.05 47.94,106.05 49.12,107.22 A3.C 49.12,107.09 50.16,106.05 55.47,106.05 A4.C 56.83,107.31 58.1,106.05 63.09,106.05 A5.C 64.36,107.09 65.41,106.05 70.7,106.05 | 70.7,106.05 A6.C | 70.7,106.05 B1.C 75.49,98.67 74.93,98.11 73.98,92.08 B2.C 73.66,90.81 72.39,83.82 B3.C 72.07,82.55 70.8,75.56 B4.C 70.48,73.98 69.22,67.94 B5.C G6.C | F1.C 25.08,97.79 24.13,92.08 F2.C 23.81,90.81 22.54,83.82 F3.C 22.23,82.55 20.95,75.56 F4.C 20.64,73.98 19.37,67.31 F5.C 20.03,65.41 8.26,65.41 7.3,64.45 v7.3,62.23 | v45.09,62.23 42.23,62.23 42.23,62.2 G3.C 40.99,61.57 40.32,62.23 34.61,62.23 34.61,62.2 G2.C 33.37,61.57 32.7,62.23 26.95,62.23 G1.C 25.68,61.95 25.4,62.23 v12.7,62.23 | v48.26,62.55 48.61,61.57 G4.C 49.88,62.23 55.56,62.23 56.23,61.57 G5.C 57.5,62.23 63.18,62.23 63.78,61.63 G6.C | G6.C 63.78,56.92 C1.C 66.99,51.75 65.72,46.04 C2.C 65.41,44.13 64.83,41.14 64.14,37.47 C3.C 63.82,36.2 62.55,29.53 C4.C 62.23,27.62 60.96,21.27 61.27,21.02 | 61.27,21.02 C5.C 73.21,19.92 DOT1.C | E1.C 16.51,51.75 15.56,45.72 E2.C 15.24,43.81 14.29,37.47 E3.C 13.97,35.88 12.7,29.53 E4.C 12.38,27.62 11.43,21.27 E5.C 12.94,19.92 D1.C 17.78,15.24 19.05,13.97 24.03,13.97 D2.C 25.4,15.24 26.67,13.97 31.65,13.97 D3.C 33.02,15.24 34.29,13.97 39.34,13.97 D4.C 40.64,15.24 41.91,13.97 46.89,13.97 D5.C 48.16,15.02 49.21,13.97 54.51,13.97 D6.C 55.78,15.53 61.27,21.02 | DOT1.C 75.46,17.57 76.2,16.83 78.84,16.83 DOT2.C 81.17,15.56 DOT3.C | DOT1.C 75.46,16.62 75.88,16.19 77.47,16.19 78.11,15.56 78.11,13.76 DOT4.C
  Top 0.406: v58.74,40.96 64.65,40.96 64.83,41.14
  Bottom 0.203: v45.09,62.23 v48.26,62.55 | v7.3,62.23 v12.7,62.23
  Bottom 0.406: Q4.3 48.26,40.01 49.21,40.96 v58.74,40.96
D  (via drill 0.38 pad 0.81)
  Top 0.203: v35.24,25.72 35.24,33.97 53.66,52.39 v53.66,59.37
  Bottom 0.203: D.1 53.66,60.96 | 53.66,60.96 D..1 | R57.2 31.11,20.69 Q10.1 32.97,23.45 v35.24,25.72 | v53.66,59.37 53.66,60.96
DOT
  Bottom 0.203: DOT.1 DOT..1 85.14,49.58 R69.2 85.14,36.61 Q18.1
E  (via drill 0.38 pad 0.81)
  Top 0.203: v36.2,49.53 v36.2,56.83
  Bottom 0.203: E.1 4.45,57.78 36.2,57.78 | 36.2,57.78 83.5,57.78 84.14,58.42 E..1 | Q12.1 31.75,41.64 R60.2 | Q12.1 32.12,44.09 | Q12.1 32.38,44.72 32.38,48.58 33.34,49.53 v36.2,49.53 | v36.2,56.83 36.2,57.78
F  (via drill 0.38 pad 0.81)
  Top 0.203: v50.48,70.17 50.48,66.36 46.35,62.23 46.35,57.47 v46.67,56.83
  Bottom 0.203: F.1 46.67,55.88 | 46.67,55.88 F..1 | Q14.1 38.1,72.76 R63.2 47.94,72.71 v50.48,70.17 | v46.67,56.83 46.67,55.88
G  (via drill 0.38 pad 0.81)
  Top 0.203: v45.72,48.9 v45.72,51.75
  Bottom 0.203: G..1 45.72,53.34 | 45.72,53.34 G.1 | R66.2 43.82,47.57 Q16.1 45.72,48.3 v45.72,48.9 | v45.72,51.75 45.72,53.34
GND  (via drill 0.38 pad 0.81)
  other vias: 10,3 9,4 10,5 11,4 79.85,116.98 78.85,117.98 79.85,118.98 80.85,117.98
  pour Bottom: 4,0 arc-90 0,4 0,117 0,118 arc-90 4,122 86,122 arc-90 90,118 90,4 arc-90 86,0
  pour Top: 4,0 arc-90 0,4 0,117 0,118 arc-90 4,122 86,122 arc-90 90,118 90,4 arc-90 86,0
GND_SEC
  Bottom 0.406: 113.03,56.78 R70.1
  Bottom 0.813: Q19.2 113.03,56.78 | GND_SEC.1 -_SEC.1 -_SEC1.1 | GND_SEC1.1 -_SEC1.1 | -_SEC1.1 117.47,25.4 118.75,26.67 118.75,46.35 113.03,52.07 113.03,56.25 R70.1
N$1  (via drill 0.38 pad 0.81)
  Top 0.203: v37.47,107.31 A1.A
  Bottom 0.203: R1.1 v37.47,107.31
N$2  (via drill 0.38 pad 0.81)
  Top 0.203: A3.A v52.7,107.31
  Bottom 0.203: v52.7,107.31 R3.1
N$3  (via drill 0.38 pad 0.81)
  Top 0.203: A4.A v60.33,107.31
  Bottom 0.203: v60.33,107.31 R4.1
N$4  (via drill 0.38 pad 0.81)
  Top 0.203: A5.A v67.94,107.31
  Bottom 0.203: v67.94,107.31 R5.1
N$5  (via drill 0.38 pad 0.81)
  Top 0.203: A6.A v75.56,107.31
  Bottom 0.203: v75.56,107.31 R6.1
N$6  (via drill 0.38 pad 0.81)
  Top 0.203: A2.A v45.09,107.31
  Bottom 0.203: v45.09,107.31 R2.1
N$7  (via drill 0.38 pad 0.81)
  Top 0.203: v78.74,100.97 77.19,100.97 B1.A
  Bottom 0.203: R7.1 77.73,99.96 v78.74,100.97
N$8  (via drill 0.38 pad 0.81)
  Top 0.203: v77.47,93.34 75.86,93.34 B2.A
  Bottom 0.203: R8.1 76.47,92.34 v77.47,93.34
N$9  (via drill 0.38 pad 0.81)
  Top 0.203: v75.95,85.09 74.4,85.09 B3.A
  Bottom 0.203: R9.1 74.88,84.02 v75.95,85.09
N$10  (via drill 0.38 pad 0.81)
  Top 0.203: v74.3,76.83 72.94,76.83 B4.A
  Bottom 0.203: R10.1 73.48,76.02 v74.3,76.83
N$11  (via drill 0.38 pad 0.81)
  Top 0.203: v73.66,67.31 72.33,67.31 B5.A
  Bottom 0.203: R11.1 v73.66,67.31
N$12  (via drill 0.38 pad 0.81)
  Top 0.203: C1.A 70.88,54.37 v71.12,54.61
  Bottom 0.203: v71.12,54.61 R12.1
N$13  (via drill 0.38 pad 0.81)
  Top 0.203: v69.85,46.99 67.67,46.99 C2.A
  Bottom 0.203: R13.1 68.58,45.72 v69.85,46.99
N$14  (via drill 0.38 pad 0.81)
  Top 0.203: C3.A 67.99,38.5 v68.01,38.48
  Bottom 0.203: v68.01,38.48 67.64,38.48 R14.1
N$15  (via drill 0.38 pad 0.81)
  Top 0.203: v67.31,30.48 64.74,30.48 C4.A
  Bottom 0.203: R15.1 v67.31,30.48
N$16  (via drill 0.38 pad 0.81)
  Top 0.203: C5.A 65.13,21.99 v65.15,21.97
  Bottom 0.203: v65.15,21.97 64.78,21.97 R16.1
N$17  (via drill 0.38 pad 0.81)
  Top 0.203: D1.A v21.59,15.24
  Bottom 0.203: v21.59,15.24 R17.1
N$18  (via drill 0.38 pad 0.81)
  Top 0.203: D2.A v29.21,15.24
  Bottom 0.203: v29.21,15.24 R18.1
N$19  (via drill 0.38 pad 0.81)
  Top 0.203: D3.A v36.83,15.24
  Bottom 0.203: v36.83,15.24 R19.1
N$20  (via drill 0.38 pad 0.81)
  Top 0.203: D4.A v44.45,15.24
  Bottom 0.203: v44.45,15.24 R20.1
N$21  (via drill 0.38 pad 0.81)
  Top 0.203: D5.A v52.07,15.24
  Bottom 0.203: v52.07,15.24 R21.1
N$22  (via drill 0.38 pad 0.81)
  Top 0.203: D6.A v59.69,15.24
  Bottom 0.203: v59.69,15.24 R22.1
N$23  (via drill 0.38 pad 0.81)
  Top 0.203: v20.95,54.61 19.02,54.61 E1.A
  Bottom 0.203: R23.1 v20.95,54.61
N$24  (via drill 0.38 pad 0.81)
  Top 0.203: v19.05,46.99 17.69,46.99 E2.A
  Bottom 0.203: R24.1 18.11,46.05 v19.05,46.99
N$25  (via drill 0.38 pad 0.81)
  Top 0.203: v17.78,38.73 16.23,38.73 E3.A
  Bottom 0.203: R25.1 16.77,37.73 v17.78,38.73
N$26  (via drill 0.38 pad 0.81)
  Top 0.203: v17.14,30.48 14.77,30.48 E4.A
  Bottom 0.203: R26.1 v17.14,30.48
N$27  (via drill 0.38 pad 0.81)
  Top 0.203: v14.61,22.23 13.31,22.23 E5.A
  Bottom 0.203: R27.1 13.79,21.41 v14.61,22.23
N$28  (via drill 0.38 pad 0.81)
  Top 0.203: v28.57,100.97 27.21,100.97 F1.A
  Bottom 0.203: R28.1 27.7,100.09 v28.57,100.97
N$29  (via drill 0.38 pad 0.81)
  Top 0.203: v27.3,93.34 25.88,93.34 F2.A
  Bottom 0.203: R29.1 26.36,92.4 v27.3,93.34
N$30  (via drill 0.38 pad 0.81)
  Top 0.203: v25.91,85.03 24.36,85.03 F3.A
  Bottom 0.203: R30.1 24.9,84.02 v25.91,85.03
N$31  (via drill 0.38 pad 0.81)
  Top 0.203: v24.45,76.9 23.02,76.9 F4.A
  Bottom 0.203: R31.1 23.44,75.89 v24.45,76.9
N$32  (via drill 0.38 pad 0.81)
  Top 0.203: v23.5,67.31 22.3,67.31 F5.A
  Bottom 0.203: R32.1 23.43,67.25 v23.5,67.31
N$33  (via drill 0.38 pad 0.81)
  Top 0.203: G1.A 28.13,60.96 v29.4,59.69
  Bottom 0.203: v29.4,59.69 R33.1
N$34  (via drill 0.38 pad 0.81)
  Top 0.203: G2.A 35.56,60.96 v36.83,59.69
  Bottom 0.203: v36.83,59.69 R34.1
N$35  (via drill 0.38 pad 0.81)
  Top 0.203: G3.A 43.18,60.96 v44.45,59.69
  Bottom 0.203: v44.45,59.69 R35.1
N$36  (via drill 0.38 pad 0.81)
  Top 0.203: G4.A 50.8,60.96 v52.07,59.69
  Bottom 0.203: v52.07,59.69 R36.1
N$37  (via drill 0.38 pad 0.81)
  Top 0.203: G5.A 58.42,60.96 v59.69,59.69
  Bottom 0.203: v59.69,59.69 R37.1
N$38  (via drill 0.38 pad 0.81)
  Top 0.203: G6.A 66.04,60.96 v67.31,59.69
  Bottom 0.203: v67.31,59.69 R38.1
N$39  (via drill 0.38 pad 0.81)
  Top 0.203: DOT1.A 78,19.16 v78.74,18.41
  Bottom 0.203: v78.74,18.41 R39.1
N$40  (via drill 0.38 pad 0.81)
  Top 0.203: v83.82,16.51 | v83.82,16.51 DOT2.A
  Bottom 0.203: R40.1 82.81,17.52 v83.82,16.51
N$41  (via drill 0.38 pad 0.81)
  Top 0.203: DOT3.A 82.02,12.59 v83.19,11.43
  Bottom 0.203: v83.19,11.43 83.19,12.96 R41.1
N$42  (via drill 0.38 pad 0.81)
  Top 0.203: v76.83,15.24 76.62,15.24 DOT4.A
  Bottom 0.203: R42.1 77.1,14.97 v76.83,15.24
N$43
  Bottom 0.203: Q2.1 68.89,100.33 | 68.89,100.33 68.89,98.79 R45.2 | R44.1 65.14,99.11 66.36,100.33 68.89,100.33
N$44
  Bottom 0.203: Q1.3 65.63,97.33 R45.1
N$45
  Bottom 0.203: Q5.1 64.13,75.61 R50.2 64.08,75.94 63.18,76.83 60.27,76.83 R49.1
N$46
  Bottom 0.203: 35.27,108.56 35.3,108.58 40.64,108.58 41.65,107.58 R2.2 42.91,108.58 48.58,108.58 49.27,107.9 | 35.27,108.56 R1.2 | R3.2 49.27,107.9 | R4.2 56.88,107.9 | 56.88,107.9 56.2,108.58 49.95,108.58 49.27,107.9 | R5.2 64.5,107.58 63.5,108.58 57.57,108.58 56.88,107.9 | R6.2 72.12,107.9 71.44,108.58 65.78,108.58 R5.2 | 35.24,108.58 35.27,108.56 | Q2.3 67.94,103.88 R5.2
N$47
  Bottom 0.203: R47.1 49.31,33.39 Q3.1 49.21,32.7 48.58,32.07 45.45,32.07 R46.1
N$48  (via drill 0.38 pad 0.81)
  Top 0.203: v42.23,35.56 45.72,35.56 v46.35,36.2
  Bottom 0.203: R48.2 49.31,37.52 Q4.1 49.21,36.34 Q3.3 47.45,36.2 v46.35,36.2 | JP2.2 41.91,35.24 v42.23,35.56
N$49  (via drill 0.38 pad 0.81)
  Top 0.203: v68.26,69.53 v68.26,67.31
  Bottom 0.203: R7.2 R8.2 R9.2 R10.2 | R10.2 v68.26,69.53 | v68.26,67.31 R11.2 | Q5.3 67.03,80.16 R10.2
N$50
  Bottom 0.203: R58.1 25.4,41.64 Q11.1 26.98,44.09 R59.2
N$51
  Bottom 0.203: R59.1 27.99,41.65 28.89,42.55 28.89,45.72 29.21,46.04 30.65,46.04 Q12.3
N$52
  Bottom 0.203: R50.1 61.13,75.56 Q6.3
N$53
  Bottom 0.203: Q7.1 R52.1 56.15,43.18 R53.2
N$54
  Bottom 0.203: R53.1 56.2,46.99 56.83,47.62 59.23,47.62 Q8.3
N$55  (via drill 0.38 pad 0.81)
  Top 0.203: v63.18,54.61 v63.18,49.53 | v60.64,30.48 v60.64,25.72
  Bottom 0.203: R12.2 v63.18,54.61 | v63.18,49.53 R13.2 | R13.2 R14.2 R15.2 v60.64,30.48 | v60.64,25.72 R16.2 | Q7.3 53.02,47.94 54.29,49.21 61.28,49.21 64.77,45.72 R13.2
N$56
  Bottom 0.203: Q9.1 24.76,20.69 R55.1 26.93,20.64 R56.2
N$57
  Bottom 0.203: Q10.3 28.41,25.55 26.99,24.13 R56.1
N$58
  Bottom 0.203: R17.2 17.77,15.55 18.73,16.51 20.64,16.51 | 20.64,16.51 24.18,16.51 R18.2 25.45,15.29 26.67,16.51 31.8,16.51 R19.2 33.07,15.29 34.29,16.51 39.49,16.51 R20.2 40.76,15.36 41.91,16.51 47.04,16.51 R21.2 48.31,15.61 49.21,16.51 54.66,16.51 R22.2 | Q9.3 22.37,25.23 20.95,23.81 20.95,16.83 20.64,16.51
N$59  (via drill 0.38 pad 0.81)
  Top 0.203: v18.1,69.53 v18.1,67.31
  Bottom 0.203: R28.2 R29.2 R30.2 22.38,79.72 | 22.38,79.72 22.22,78.85 R31.2 18.1,72.02 v18.1,69.53 | Q13.3 28.06,79.72 22.38,79.72 | v18.1,67.31 18.16,67.25 R32.2
N$60
  Bottom 0.203: Q13.1 R61.1 33.55,74.56 R62.2
N$61
  Bottom 0.203: Q14.3 36.02,76.98 35.24,76.2 35.24,74.03 R62.1
N$62  (via drill 0.38 pad 0.81)
  Top 0.203: v39.69,49.85 39.37,50.16 39.37,59.05 v38.73,59.69
  Bottom 0.203: R33.2 27.04,58.42 32.07,58.42 33.34,59.69 R34.2 34.79,58.42 38.42,58.42 | 38.42,58.42 40.64,58.42 41.14,58.92 | 41.14,58.92 R35.2 | 41.14,58.92 41.41,58.92 41.91,58.42 47.49,58.42 R36.2 50.03,58.42 55.56,58.42 56.38,59.23 R37.2 57.65,58.42 63.18,58.42 63.93,59.17 R38.2 | Q15.3 39.69,48.41 v39.69,49.85 | v38.73,59.69 38.73,58.74 38.42,58.42
N$63
  Bottom 0.203: R64.1 39.69,43.23 Q15.1 40.33,44.72 R65.2
N$64
  Bottom 0.203: Q16.3 43.38,42.91 R65.1
N$65  (via drill 0.38 pad 0.81)
  Top 0.203: v81.28,29.84 v81.28,26.67
  Bottom 0.203: R42.2 R39.2 76.57,19.68 80.01,19.68 | R41.2 R40.2 81.02,18.68 80.01,19.68 | Q17.3 v81.28,29.84 | v81.28,26.67 81.28,20.95 80.01,19.68
N$66
  Bottom 0.203: 80.38,36.29 78.25,36.29 R67.1 | R68.2 80.38,36.29 | 80.38,36.29 Q17.1
N$67
  Bottom 0.203: R68.1 83.5,38.42 83.82,38.1 83.82,34.92 84.14,34.61 85.89,34.61 Q18.3
N$68
  Bottom 0.203: R47.2 50.11,35.19 49.21,34.29 48.31,34.29 Q3.2 JP1.1
N$69  (via drill 0.38 pad 0.81)
  Top 0.203: v15.56,54.61 v14.61,46.99 | v11.75,30.48 v10.48,22.54
  Bottom 0.203: R23.2 v15.56,54.61 | v14.61,46.99 R24.2 | R24.2 R25.2 R26.2 v11.75,30.48 | v10.48,22.54 R27.2 | Q11.3 22.08,46.19 20,48.26 18.85,48.26 R24.2
N$70
  Bottom 0.813: R72.1 108.85,37.65 LED2.A
N$71
  Bottom 0.406: 116.47,83.81 LED1.A
  Bottom 0.813: R71.1 116.47,83.81
N$75
  Bottom 0.813: LED1.K 119,67.08 Q19.3 111.59,62.06 109.86,60.33 109.86,46.35 111.12,45.09 111.12,38.29 LED2.K
SEC
  Bottom 0.406: 114.93,56.88 R70.2
  Bottom 0.813: Q19.1 114.93,56.88 | SEC.1 116.84,17.78 | 116.84,17.78 116.84,19.68 113.03,19.68 113.03,15.88 116.84,15.88 116.84,17.78 | 116.84,17.78 118.75,17.78 121.28,20.32 121.28,46.99 114.94,53.34 114.94,56.15 R70.2
VCC  (via drill 0.38 pad 0.81, 0.38 pad 1.02, 0.38 pad 1.27)
  Top 0.203: v29.84,69.53 29.84,63.82 | 10.16,57.15 9.84,56.83 | v50.8,25.4 50.8,35.24 v45.72,40.32 | v76.2,29.21 76.2,28.26 v74.3,26.35
  Top 0.406: v26.67,26.04 v26.67,29.53
  Top 0.61: v34.92,46.35 34.92,48.58 26.35,57.15 10.16,57.15
  Top 1.016: ON.3 9.84,47.94 9.84,56.83 9.84,63.5 10.16,63.82 29.84,63.82 44.77,63.82 48.26,67.31 v48.26,83.19
  Bottom 0.203: Q2.2 65.41,101.55 R44.2 63.82,101.86 63.82,102.87 63.5,103.19 59.37,103.19 48.26,92.08 v48.26,83.19 53.39,78.05 R49.2 Q5.2 | Q13.2 R61.2 29.9,69.58 v29.84,69.53 | Q15.2 37.84,45.3 R64.2 | Q7.2 52.07,43.23 R52.2 | 35.24,46.04 v34.92,46.35 | Q11.2 23.5,41.64 R58.2 23.55,40.91 | R55.2 22.86,20.69 Q9.2 22.86,23.5 | Q17.2 82.18,36.29 82.18,36.14 81.28,35.24 80.33,35.24 79.38,34.29 78.16,34.29 R67.2 78.11,31.11 v76.2,29.21 | v50.8,25.4 60.01,16.19 62.55,16.19 72.71,26.35 v74.3,26.35 | v45.72,40.32 45.72,41.91 | JP1.2 44.13,41.91
  Bottom 0.406: Q15.2 35.92,45.35 v34.92,46.35 | Q7.2 51.39,45.67 47.62,41.91 45.72,41.91 44.13,41.91 36.2,41.91 34.92,43.18 v34.92,46.35 | 23.55,40.91 25.08,39.37 26.67,39.37 | 26.67,39.37 31.75,39.37 33.34,40.96 33.34,44.77 v34.92,46.35 | 22.86,23.5 23.18,23.5 23.81,24.13 24.77,24.13 v26.67,26.04 | v26.67,29.53 26.67,39.37
VCC_1
  Bottom 0.813: R71.2 114.67,70.22 105.41,60.96 105.41,34.66 105.59,34.48 | 105.59,34.48 R72.2 | 105.59,34.48 105.41,34.29 105.41,31.11 108.58,27.94 5V_SEC1.1 5V_SEC.1

### Text on the board
tNames: A | F | B | G | !EN! | E | C | 5V | - | GND | DOT | D
bNames: To make Enable pin Active HIGH | cut JP1 and bridge JP2